# EAGLE design isocan (EAGLE 4.13)
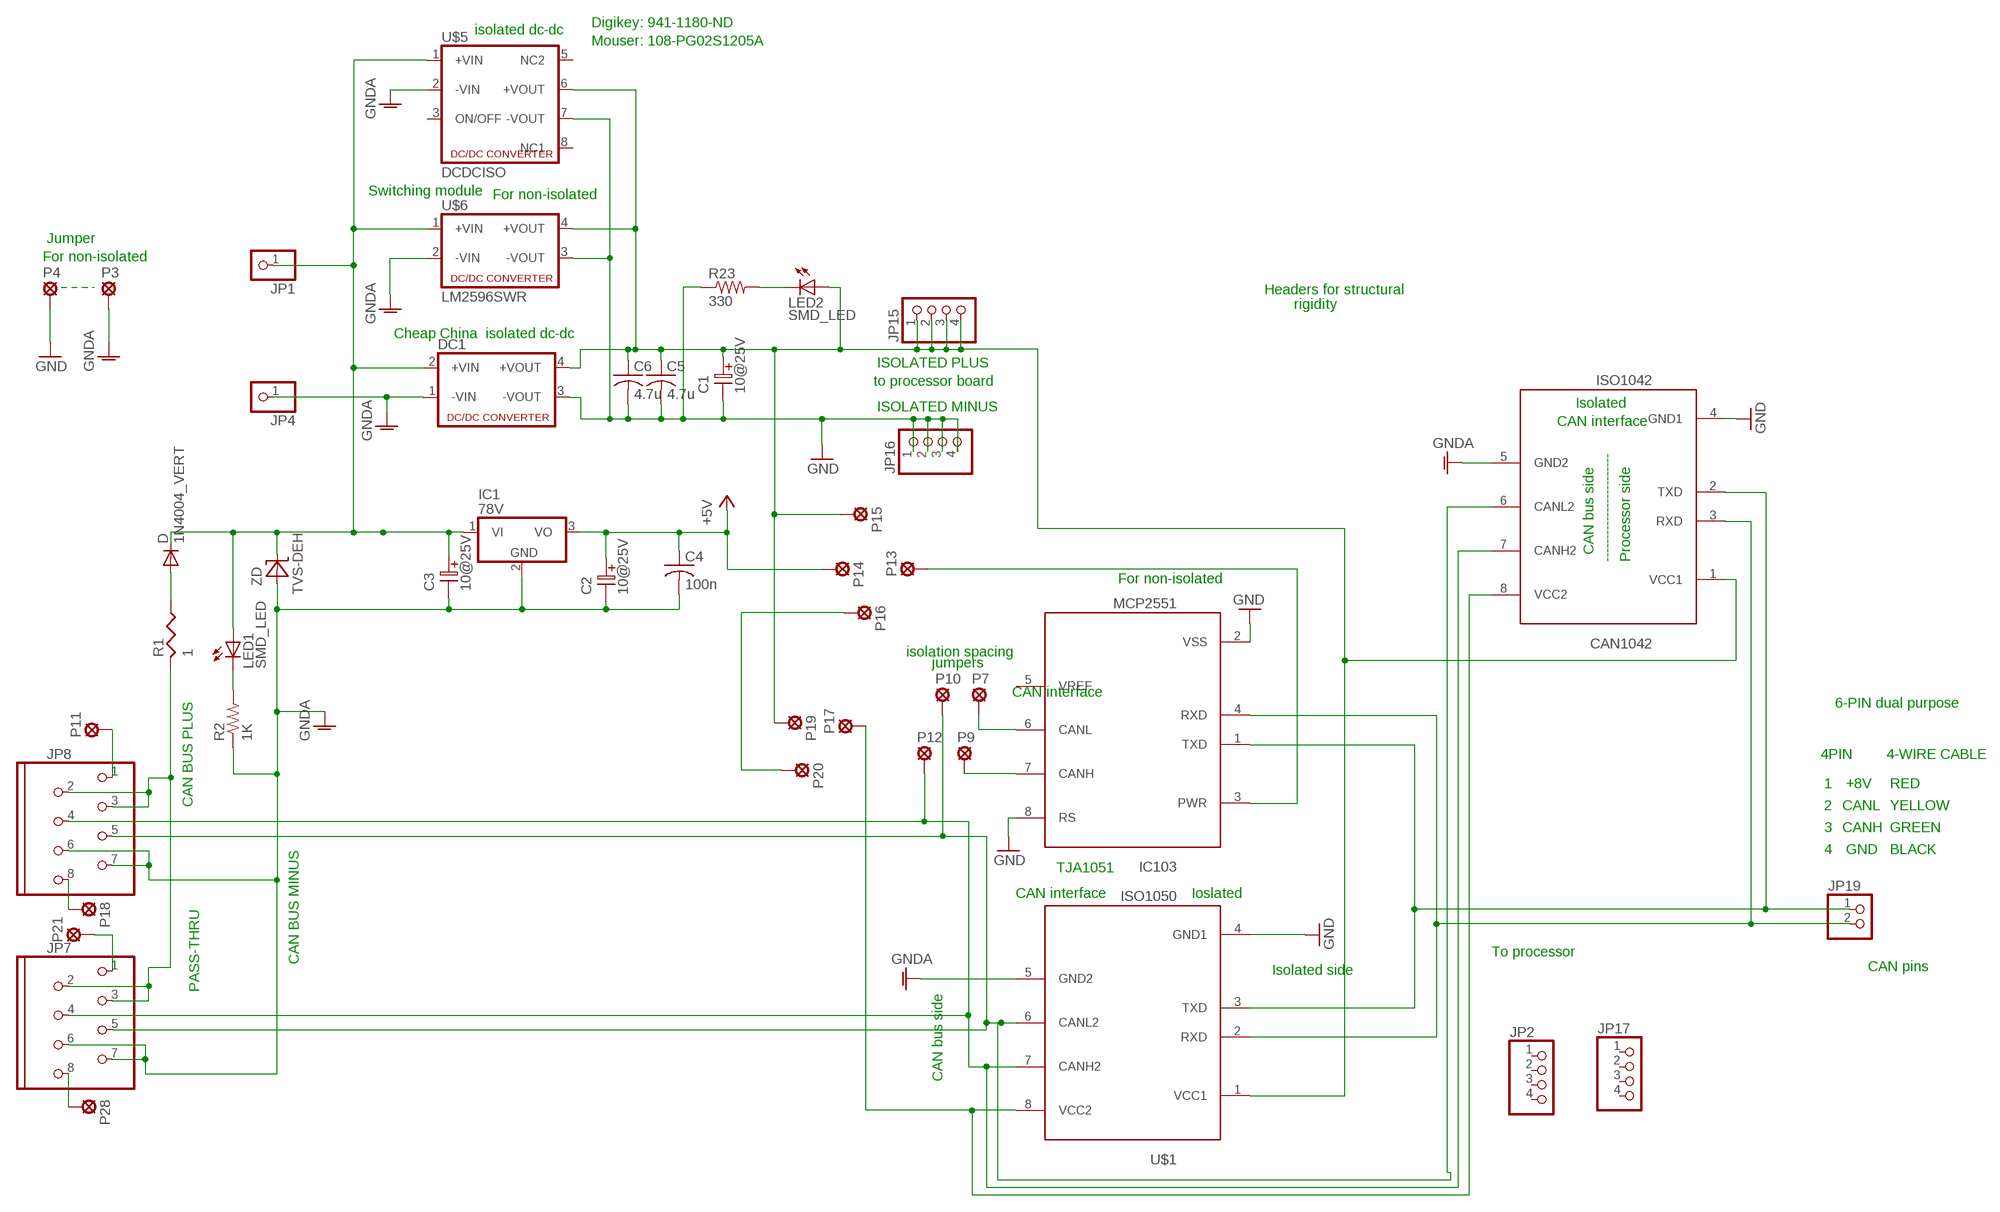
[diagram p0: schematic, sheet 1]

## Parts
C1  10@25V  ELC-2,5L  [ES-2,5L]
C2  10@25V  ELC-2,5L  [ES-2,5L]
C3  10@25V  ELC-2,5L  [ES-2,5L]
C4  100n  C-USC0603  [C0603]
C5  4.7u  C-USC0603  [C0603]
C6  4.7u  C-USC0603  [C0603]
CAN1042  ISO1042  [SO-08]
D  1N4004_VERT  [DO41-10_VERT]
DC1  NME  [NME]
IC1  78V  [TO220V]
IC103  MCP2551  [SO-08@1]
JP1  PINHD-1X1  [1X01]
JP2  PINHD-1X4  [1X04]
JP4  PINHD-1X1  [1X01]
JP7  MOD8P8C  [MOD8P8C]
JP8  MOD8P8C  [MOD8P8C]
JP15  PINHD-1X4  [1X04]
JP16  PINHD-1X4  [1X04]
JP17  PINHD-1X4  [1X04]
JP19  PINHD-1X2  [1X02]
LED1  SMD_LED  [SMD_LED]
LED2  SMD_LED  [SMD_LED]
P3  SOLPAD035  [SOLDPAD035]
P4  SOLPAD035  [SOLDPAD035]
P7  SOLPAD035  [SOLDPAD035]
P9  SOLPAD035  [SOLDPAD035]
P10  SOLPAD035  [SOLDPAD035]
P11  SOLPAD035  [SOLDPAD035]
P12  SOLPAD035  [SOLDPAD035]
P13  SOLPAD035  [SOLDPAD035]
P14  SOLPAD035  [SOLDPAD035]
P15  SOLPAD035  [SOLDPAD035]
P16  SOLPAD035  [SOLDPAD035]
P17  SOLPAD035  [SOLDPAD035]
P18  SOLPAD035  [SOLDPAD035]
P19  SOLPAD035  [SOLDPAD035]
P20  SOLPAD035  [SOLDPAD035]
P21  SOLPAD035  [SOLDPAD035]
P28  SOLPAD035  [SOLDPAD035]
R1  1  RESUS-S2,5  [RS-2,5]
R2  1K  R-US_R0603  [R0603]
R23  330  R-US_R0603  [R0603]
U$1  ISO1050  [PDSO-G8]
U$5  DCDCISO  [DCDC7PIN]
U$6  LM2596SWR  [LM2596SW]
ZD  TVS-DEH  [TVS-DEH]

## Nets
78L05_+: P16.MP P20.MP
+5V: C2.1 C4.1 IC1.3(VO) P14.MP
+12V_RESISTORED: D.A R1.1
CAN_DRVR_RXD: CAN1042.3(RXD) IC103.4(RXD) JP19.2 U$1.2(RXD)
CAN_DRVR_TXD: CAN1042.2(TXD) IC103.1(TXD) JP19.1 U$1.3(TXD)
CAN_PROTECTED+: C3.1 D.C DC1.2(+VIN) IC1.1(VI) JP1.1 LED1.A U$5.1(+VIN) U$6.1(+VIN) ZD.C
CAN_RAW_PLUS: JP7.2 JP7.3 JP8.2 JP8.3 R1.2
CANCABLE_1_1: JP8.1 P11.MP
CANCABLE_1_8: JP8.8 P18.MP
CANCABLE_2_1: JP7.1 P21.MP
CANCABLE_2_8: JP7.8 P28.MP
CANH: CAN1042.7(CANH2) JP7.4 JP8.4 P12.MP U$1.7(CANH2)
CANL: CAN1042.6(CANL2) JP7.5 JP8.5 P10.MP U$1.6(CANL2)
GND: C1.2 C5.2 C6.2 CAN1042.4(GND1) DC1.3(-VOUT) IC103.2(VSS) IC103.8(RS) JP16.1 JP16.2 JP16.3 JP16.4 P4.MP R23.1 U$1.4(GND1) U$5.7(-VOUT) U$6.3(-VOUT)
GNDA: C2.2 C3.2 C4.2 CAN1042.5(GND2) DC1.1(-VIN) IC1.2(GND) JP4.1 JP7.6 JP7.7 JP8.6 JP8.7 P3.MP R2.1 U$1.5(GND2) U$5.2(-VIN) U$6.2(-VIN) ZD.A
ISO1050_VCC2: CAN1042.8(VCC2) P17.MP U$1.8(VCC2)
ISO_PLUS: C1.1 C5.1 C6.1 CAN1042.1(VCC1) DC1.4(+VOUT) JP15.1 JP15.2 JP15.3 JP15.4 LED2.A P15.MP P19.MP U$1.1(VCC1) U$5.6(+VOUT) U$6.4(+VOUT)
LED_BUS_PWR: LED1.C R2.2
LED_EXT_BRD_PWR: LED2.C R23.2
MCP2551_CANH: IC103.7(CANH) P9.MP
MCP2551_CANL: IC103.6(CANL) P7.MP
MCP2551_PWR: IC103.3(PWR) P13.MP
Unconnected: IC103.5(VREF) JP2.1 JP2.2 JP2.3 JP2.4 JP17.1 JP17.2 JP17.3 JP17.4 U$5.3(ON/OFF) U$5.5(NC2) U$5.8(NC1)

## Notes on the sheet
- Digikey: 941-1180-ND
- isolated dc-dc
- Mouser: 108-PG02S1205A
- Switching module | For non-isolated
- Jumper
- For non-isolated
- Headers for structural
- rigidity
- Cheap China | isolated dc-dc
- ISOLATED PLUS
- to processor board
- ISOLATED MINUS | Isolated
- CAN interface
- CAN bus side
- ------------------------ | Processor side
- For non-isolated
- isolation spacing
- jumpers
- CAN interface
- 6-PIN dual purpose
- 4PIN | 4-WIRE CABLE
- 1 | +8V | RED
- CAN BUS PLUS | 2 | CANL | YELLOW
- 3 | CANH | GREEN
- 4 | GND | BLACK
- TJA1051
- CAN interface | Ioslated
- PASS-THRU
- To processor
- CAN BUS MINUS
- Isolated side | CAN pins
- CAN bus side

## Library data of the parts
C1-C3 = DEH:ELC-2,5L
C4-C6 = rcl:C-US: CAPACITOR, American symbol
CAN1042 = texas:ISO1042
D = diode:1N4004_VERT
DC1 = dc-dc-converter:NME: DC-DC CONVERTER
IC1 = linear:78*: Positive VOLTAGE REGULATOR
IC103 = texas:MCP2551
JP1 JP4 = pinhead:PINHD-1X1: PIN HEADER
JP2 JP15-JP17 = pinhead:PINHD-1X4: PIN HEADER
JP7 JP8 = DEH:MOD8P8C
JP19 = pinhead:PINHD-1X2: PIN HEADER
LED1 LED2 = led:SMD_LED
P3 P4 P7 P9-P21 P28 = solpad:SOLPAD035
R1 = DEH:RESUS-S2,5
R2 R23 = rcl:R-US_: RESISTOR, American symbol
U$1 = texas:ISO1050
U$5 = dc-dc-converter:DCDCISO
U$6 = dc-dc-converter:LM2596SWR
ZD = diode-1:TVS-DEH

## Board
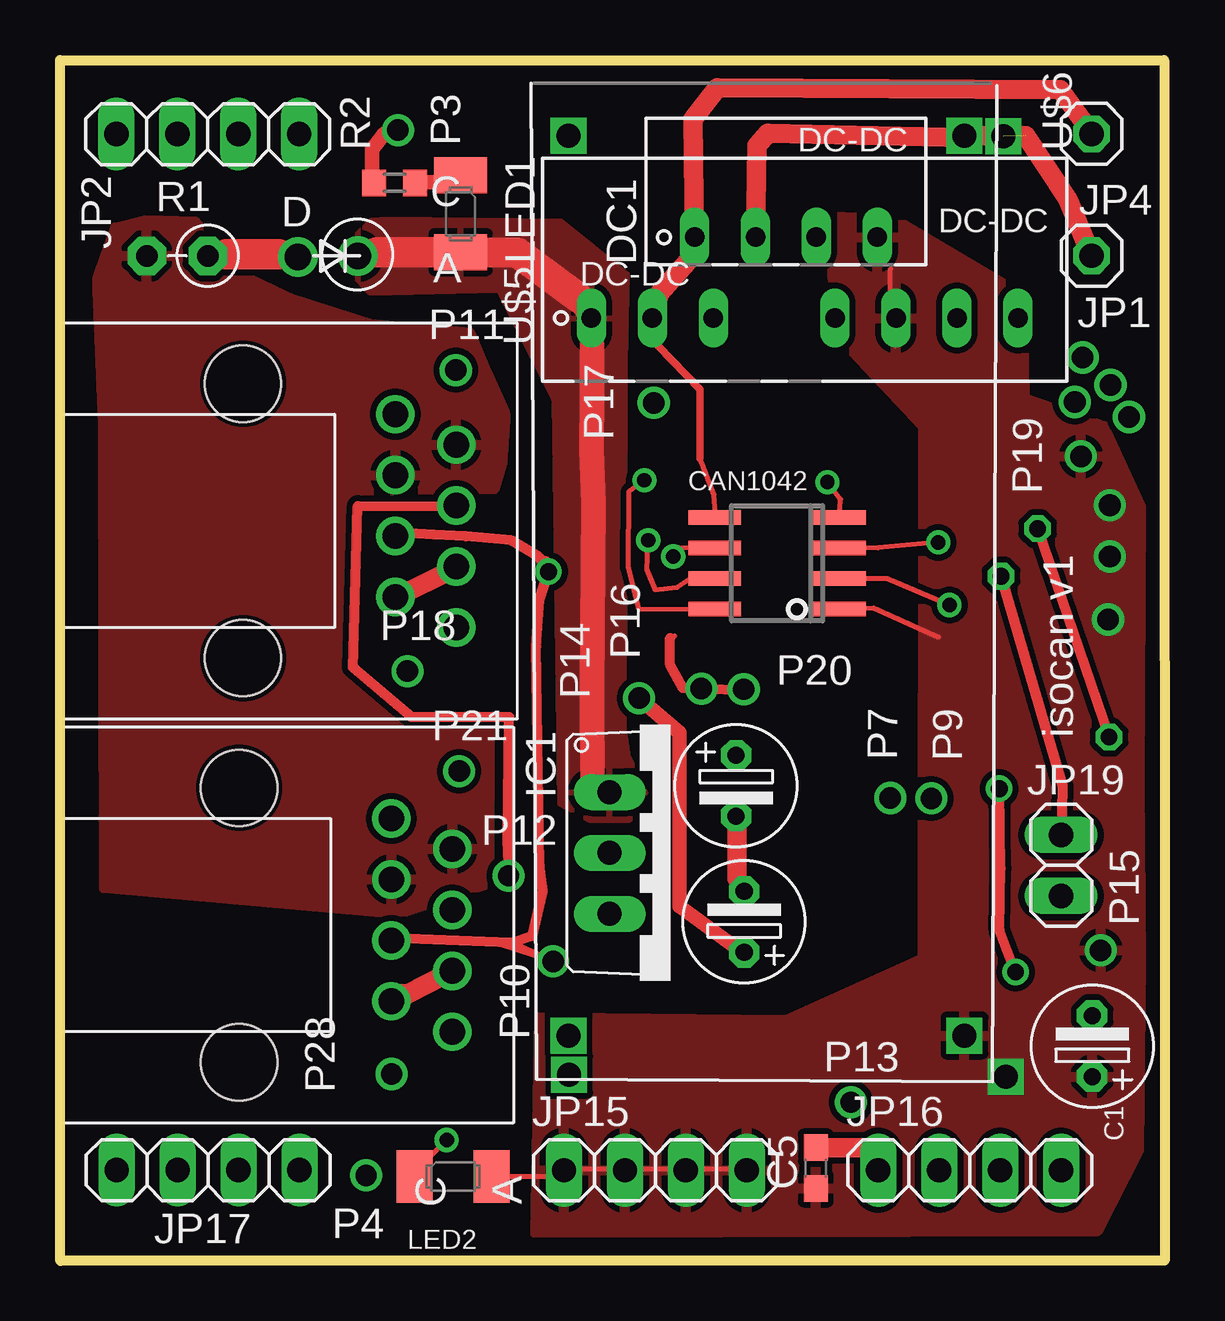
[diagram p1: board, top side]
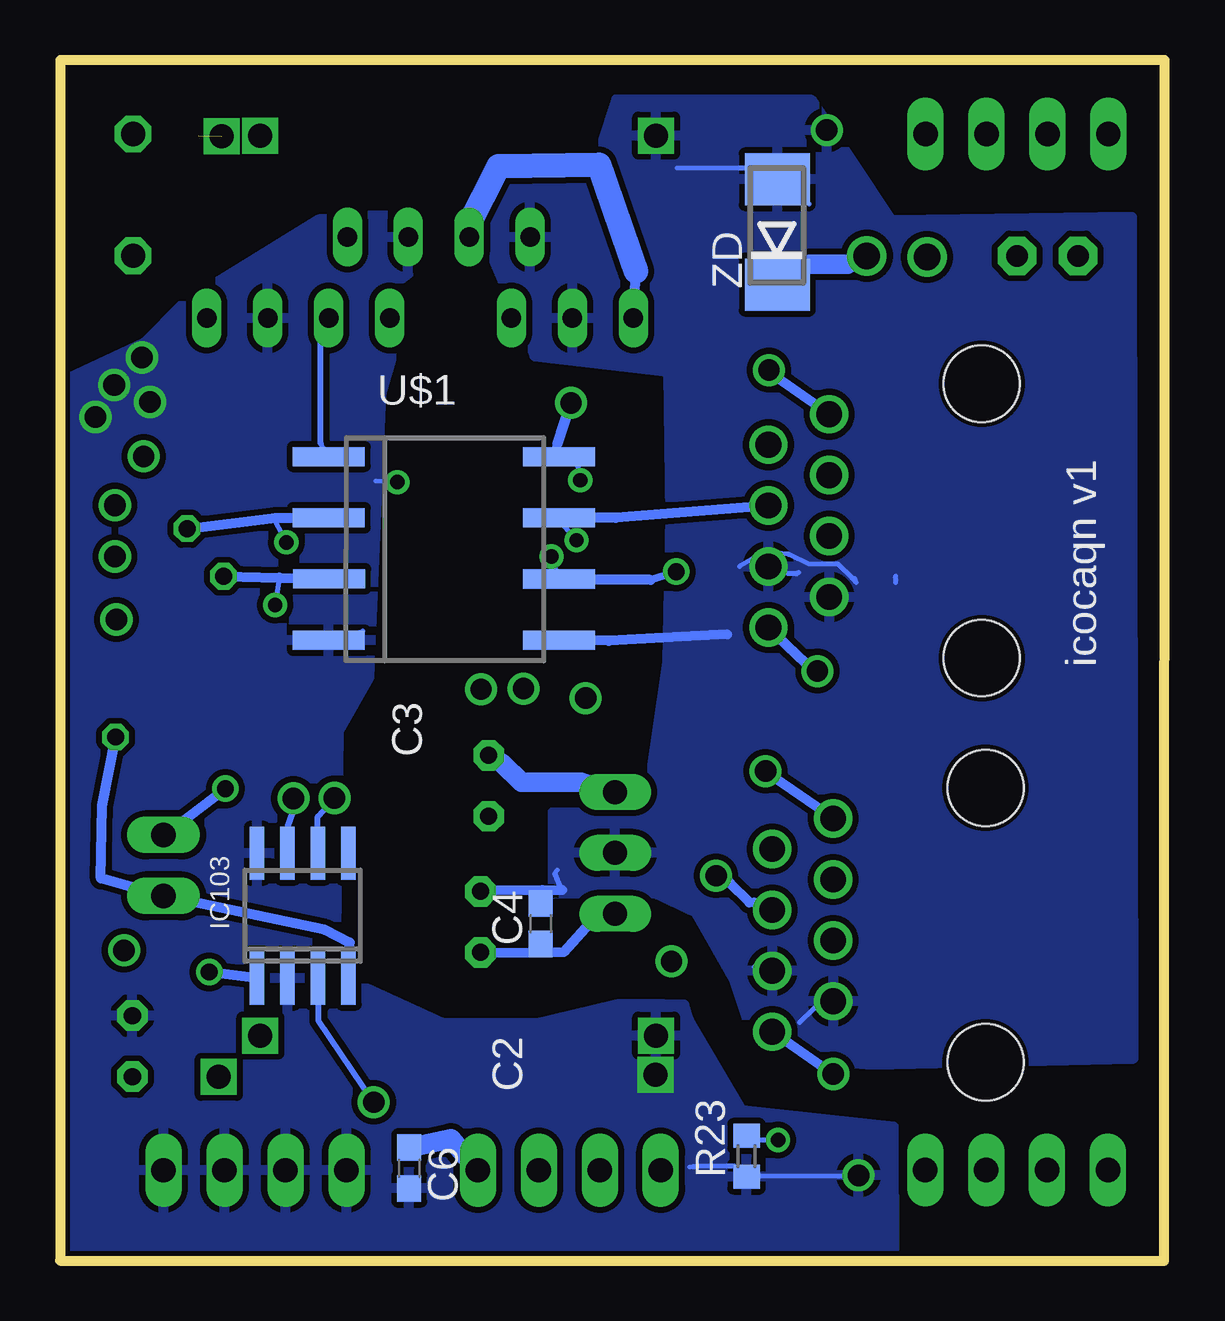
[diagram p2: board, bottom side, seen from below]

Size 46.05 x 50.04 mm. Coordinates in mm from the lower left corner, seen from the top.
Outline: 0.02,0 0,50.04 46.03,50.04 46.05,0.01 0.02,0.01
Copper layers (1*16): Top 0.035mm / dielectric 1.5mm / Bottom 0.035mm
Design rules "default": minimum track width 8mil, minimum drill 0.6mm, track to track 10mil, track to pad 10mil, pad to pad 10mil, via to via 8mil, smd to smd 0mil, copper to edge 8mil, drill to drill 8mil, minimum pad ring 8mil, minimum via ring 8mil, stop-mask expansion 4mil, vias tented up to drill 0mil, thermal gap 10mil

### Footprints (pad centres in the part's own frame; a part is rotated, then mirrored left to right if it is on the bottom)
ES-2,5L = drill 0.711 pad 1.27 octagon: 1 0,0; 2 2.54,0
C0603 = smd 1.1 x 1: 1 -0.85,0; 2 0.85,0
SO-08 = smd 0.6 x 2.2: 1 -1.905,-2.6; 2 -0.635,-2.6; 3 0.635,-2.6; 4 1.905,-2.6; 5 1.905,2.6; 6 0.635,2.6; 7 -0.635,2.6; 8 -1.905,2.6
DO41-10_VERT = drill 1.1 round: A 2.58,0.05; C 0.07,0
NME = drill 0.813 long: 1 0,3.81; 2 0,1.27; 3 0,-1.27; 4 0,-3.81
TO220V = drill 1 long: 1 -2.54,1.27; 2 0,1.27; 3 2.54,1.27
SO-08@1 = smd 0.6 x 2.2: 1 -1.905,-2.6; 2 -0.635,-2.6; 3 0.635,-2.6; 4 1.905,-2.6; 5 1.905,2.6; 6 0.635,2.6; 7 -0.635,2.6; 8 -1.905,2.6
1X01 = drill 1.016 octagon: 1 0,0
1X04 = drill 1.016 long: 1 -3.81,0; 2 -1.27,0; 3 1.27,0; 4 3.81,0
MOD8P8C = drill 1.067 pad 1.397 round: 1 -3.81,-2.54; 2 -2.54,0; 3 -1.27,-2.54; 4 0,0; 5 1.27,-2.54; 6 2.54,0; 7 3.81,-2.54; 8 5.08,0 | hole 3.175: -5.08,-8.89; 6.35,-8.89
1X02 = drill 1.016 long: 1 -1.27,0; 2 1.27,0
SMD_LED = smd 2.2 x 1.5: A 0,1.6; C 0,-1.6
SOLDPAD035 = drill 0.889 pad 1.27 round: MP 0,0
RS-2,5 = drill 0.9 pad 1.6 octagon: 1 0,0; 2 2.54,0
R0603 = smd 1 x 1.1: 1 -0.85,0; 2 0.85,0
PDSO-G8 = smd 0.8 x 3: 1 -3.825,-4.8; 2 -1.275,-4.8; 3 1.265,-4.78; 4 3.825,-4.8; 5 3.825,4.8; 6 1.275,4.8; 7 -1.275,4.81; 8 -3.825,4.81
DCDC7PIN = drill 0.813 long: 1 0,-0.03; 2 2.54,-0.03; 3 5.08,-0.03; 5 10.16,-0.03; 6 12.7,-0.03; 7 15.24,-0.03; 8 17.78,-0.03
LM2596SW = drill 1 square: 1 0,16.5; 2 0,0; 3 37.5,0; 4 37.5,16.5
TVS-DEH = smd 2.16 x 2.7: A 2.19,-0.05; C -2.2,-0.05

### Placement (x,y rotation side)
C1  43.03,7.68 90 top
C2  28.52,12.86 90 top
C3  28.18,21.07 270 top
C4  26.01,14.05 90 bottom
C5  31.5,3.87 90 top
C6  31.49,3.87 270 bottom
CAN1042  29.89,29.07 90 top
D  12.49,41.88 180 top
DC1  30.26,42.66 90 top
IC1  21.64,17 270 top
IC103  35.93,14.39 0 bottom
JP1  43,41.89 0 top
JP2  6.16,46.96 0 top
JP4  43,46.96 0 top
JP7  16.36,14.63 270 top
JP8  16.52,31.47 270 top
JP15  24.82,3.78 0 top
JP16  37.92,3.78 0 top
JP17  6.17,3.79 0 top
JP19  41.73,16.48 270 top
LED1  16.7,43.63 180 top
LED2  16.38,3.52 270 top
P3  14.09,47.12 0 top
P4  12.76,3.56 0 top
P7  34.61,19.29 0 top
P9  36.32,19.27 0 top
P10  20.56,12.48 0 top
P11  16.5,37.12 0 top
P12  18.7,16.05 0 top
P13  32.97,6.61 0 top
P14  24.14,23.45 0 top
P15  43.38,12.94 0 top
P16  26.73,23.85 0 top
P17  24.75,35.75 0 top
P18  14.48,24.58 0 top
P19  42.56,33.52 270 top
P20  28.5,23.82 0 top
P21  16.64,20.41 0 top
P28  13.82,7.79 0 top
R1  6.16,41.88 180 top
R2  13.95,44.92 0 top
R23  17.43,4.37 90 bottom
U$1  30.05,29.69 270 bottom
U$5  22.15,39.32 0 top
U$6  21.2,46.89 270 top
ZD  16.2,42.88 90 bottom

### Tracks (layer width: path | path; a pad name or v marks a point on that pad's centre or on a via)
78L05_+
  Top 0.203: 28.58,23.81 28.63,23.72 P20.MP | 25.43,25.96 25.62,26.04
  Top 0.406: 28.58,23.81 P16.MP 25.96,23.87 25.43,24.84 25.43,25.96
+5V
  Top 0.61: P14.MP 25.83,22 25.83,14.79 28.47,12.84 C2.1
  Bottom 0.203: 26.01,12.85 C4.1 26.35,12.85 | IC1.3 23.77,14.27
  Bottom 0.406: 23.11,14.44 IC1.3 23.65,14.35 | 26.01,12.85 25.05,12.87 23.77,14.27 | 26.35,12.85 27.96,12.82 C2.1
+12V_RESISTORED
  Top 1.016: R1.1 6.92,41.94 | 9.12,41.94 D.A
  Top 1.27: 6.92,41.94 9.12,41.94
CAN_DRVR_RXD  (via drill 0.6, 0.7)
  Top 0.203: CAN1042.3 34.1,29.71 v36.61,29.94
  Top 0.406: v43.73,21.83 v40.75,30.51
  Bottom 0.203: 37.06,30.96 37.06,30.78 v36.61,29.94
  Bottom 0.406: v40.75,30.51 37.06,30.96 U$1.2 | v43.73,21.83 44.3,18.96 44.35,15.94 41.57,15.16 JP19.2 41.75,15.21 35.01,13.8 33.97,13.26 IC103.4
CAN_DRVR_TXD  (via drill 0.6, 0.7)
  Top 0.203: CAN1042.2 34.47,28.43 v37.08,27.33
  Top 0.406: v39.23,28.53 41.8,19.8 41.75,17.6 JP19.1 | v39.83,12.04 39.16,13.79 39.2,16.36 v39.15,19.68
  Bottom 0.203: 36.91,28.47 36.91,28.45 v37.08,27.33
  Bottom 0.406: v39.23,28.53 36.91,28.47 U$1.3 | IC103.1 v39.83,12.04 | JP19.1 41.75,17.69 v39.15,19.68
CAN_PROTECTED+  (via drill 1)  (1 unrouted)
  Top 0.203: LED1.A 16.12,42.04
  Top 0.254: 22.15,33.81 22.49,33.81
  Top 0.406: 37.81,46.81 U$6.1 | 43.06,41.74 JP1.1
  Top 0.813: 13.22,42.04 D.C | 22.17,38.17 U$5.1 | DC1.2 29.06,46.47 29.51,46.99 37.81,46.81 | U$6.1 40.27,46.88 42.02,44.24 43.06,41.74 | 17.09,42.04 LED1.A
  Top 1.016: 22.17,38.17 22.17,36.07 22.15,33.81 22.23,31.58 22.17,23.73 22.19,19.6 IC1.1 | U$5.1 22.17,39.3 21.62,40.14
  Top 1.27: 16.12,42.04 13.22,42.04 | 21.62,40.14 19.08,42 17.09,42.04
  Bottom 0.203: 14.82,41.54 ZD.C | 29.09,43.02 DC1.2
  Bottom 0.406: U$5.1 22.05,41.24
  Bottom 0.813: 14.82,41.54 13.22,41.54 D.C | C3.1 27.62,20.74 26.82,19.94 24.32,19.94 IC1.1
  Bottom 1.016: 29.09,43.02 27.76,45.62 23.58,45.67 22.05,41.24
  other vias: 39.32,46.86
  pour Top: 12.99,43.35 11.93,42.36 11.97,41.38 12.92,40.35 18.28,40.47 20.61,35.86 20.84,19.06 22.06,18.39 23.76,18.39 24.39,19.5 23.68,21 23.52,22.14 23.56,37.48 23.64,41.1 20.88,43.31 13.7,43.39
CAN_RAW_PLUS
  pour Top: 17.78,37.05 18.57,35.3 18.43,33.26 18.09,32.15 13.82,32.11 12.07,31.7 12.07,25.38 17.9,22.66 17.88,15.71 14.1,14.45 1.84,15.52 1.8,34.9 1.56,40.95 2.3,43.06 3.62,43.38 5.61,43.33 7.53,41.12 9.72,40.07 12.92,39.05 17.09,38.69
CANCABLE_1_1
  Bottom 0.406: P11.MP 16.6,37.12 JP8.1
CANCABLE_1_8
  Bottom 0.406: P18.MP 14.56,24.53 JP8.8
CANCABLE_2_1
  Bottom 0.406: P21.MP 16.6,20.36 JP7.1
CANCABLE_2_8
  Bottom 0.406: P28.MP 13.77,7.73 JP7.8
CANH  (via drill 0.6)
  Top 0.203: CAN1042.7 26.19,28.38 25.72,28.07 24.8,27.97 24.45,28.83 24.48,29.81 v24.52,30.03
  Top 0.406: P12.MP 18.69,16.58 18.65,17.54 18.72,22.66 14.65,22.66 12.21,24.72 12.41,31.45 JP8.4
  Bottom 0.203: 17.12,14.94 17.32,14.94 | U$1.7 25.37,30.98 v24.52,30.03
  Bottom 0.406: 17.32,14.94 18.12,15.74 P12.MP | JP7.4 17.12,14.94 | U$1.7 22.88,30.96 JP8.4
CANL  (via drill 0.6, 0.7)
  Top 0.203: 13.64,13.4 13.92,13.46 18.3,13.22 P10.MP | 19.94,29.35 20.34,29.23 v20.36,28.72 | JP8.5 14.01,30.24 14.01,30.26 | v25.56,29.35 25.79,29.72 27.27,29.75 CAN1042.6
  Top 0.254: P10.MP 18.8,13.27 18.84,13.25 | 13.92,13.46 13.83,13.41
  Top 0.406: JP7.5 13.64,13.4 | v20.36,28.72 19.98,27.55 19.85,25.6 19.99,16.47 20.13,15.43 19.69,13.55 18.84,13.25 | 13.99,30.26 14.01,30.26 14.56,30.32 15.58,30.26 16.92,30.19 18.8,30.02 19.94,29.35 20.35,28.69 | 13.92,13.46 18.8,13.27
  Bottom 0.203: 25.18,28.38 U$1.6 v25.56,29.35
  Bottom 0.305: v20.36,28.72 21.43,28.38
  Bottom 0.406: 21.43,28.38 25.18,28.38
GND  (via drill 0.6, 0.9, 1)
  Top 0.203: CAN1042.4 32.54,31.74 v31.99,32.45
  Top 0.813: C5.2 33.78,4.72 34.08,3.73 JP16.1
  Bottom 0.203: P4.MP 13.42,3.54 16.92,3.54 R23.1 17.92,3.94 19.52,3.94 | 19.52,3.94 19.68,3.92 | U$1.4 33.42,26.24 | 19.52,3.94 19.62,3.92 19.79,3.91 | v31.99,32.45 32.89,32.49
  other vias: 42.63,37.64 43.79,36.5 42.3,35.79 44.57,35.17 21.22,7.76
  pour Bottom: 22.71,10.71 26.12,9.9 30.13,9.92 34.54,11.95 34.41,22.1 33.15,24.33 32.64,36.16 32.17,37.83 32.12,40.68 31.24,41.34 31.25,43.5 34.68,43.64 35.26,43.38 40.92,39.9 42.54,38.26 46.61,36.37 46.95,-1.22 19.52,-1.19 11.27,0 11.29,5.6 17.63,6.28 19.83,10.04 20.03,10.68 20.85,10.69
GNDA
  Top 0.203: 26.46,41.98 26.42,42.13 | R2.1 13.02,45.09 | 14.02,27.66 13.99,27.96 JP8.7 | JP8.6 | 15.23,11.51 15.23,11.5 15.26,11.45 13.99,11.45 JP7.7 | 26.68,33.45 27.27,31.93 27.33,31.14 CAN1042.5
  Top 0.305: 26.68,33.45 26.68,36.32 24.92,38.14 U$5.2
  Top 0.406: 43.06,46.92 JP4.1
  Top 0.61: 13.02,45.09 13,46.33 13.51,46.97 P3.MP
  Top 0.813: 26.46,41.98 25.02,40.34 U$5.2 | 26.42,42.13 DC1.1 26.39,47.58 27.41,48.88 41.7,48.8 43.06,46.92 | C3.2 28.22,17.94 28.22,15.94 C2.2 | 14.01,27.7 14.02,27.66 16.44,28.84 | 13.83,10.77 15.23,11.5 16.4,12.11
  Bottom 0.203: 15.42,28.64 15.72,28.64 | 15.42,28.64 15.32,28.64 | 15.22,9.94 14.62,10.54 JP7.7 | JP7.6 17.12,12.24 | 20.32,45.54 17.42,45.54 ZD.A 14.82,44.04 | 15.26,28.68 15.42,28.64 | 17.72,28.94 16.73,29.54 15.67,29.44 14.82,29.04 13.62,29.04 13.02,28.44 12.97,28.39 | 12.97,28.39 12.89,28.31 | 11.22,28.54 11.21,28.41 11.22,28.34 11.22,28.27 | 25.12,15.45 25.42,16.14 25.33,16.28 | 25.95,15.46 C4.2 25.74,15.42 | 12.97,28.39 12.92,28.44 12.87,28.26
  Bottom 0.406: 18.24,26.11 23.17,25.84 U$1.5 | 25.95,15.46 25.12,15.45 | 25.74,15.42 27.92,15.44 C2.2
  pour Bottom: 16.92,8.58 12.21,8.17 1.3,8.43 1.36,43.5 11.37,43.37 14.71,48.38 22.86,48.41 23.47,46.51 28.1,45.16 28.18,42.17 26.27,37.7 20.71,37.06 20.63,31 20.68,28.01 20.74,24.95 21.65,18.8 22.36,18.67 25.52,18.68 25.51,15.3 21.25,15.32 19.57,14.53 17.96,11.72
ISO1050_VCC2  (via drill 0.6)
  Top 0.203: CAN1042.8 24.14,27.18 23.69,28.9 23.72,32.07 v24.36,32.53
  Bottom 0.203: 25.32,34.04 25.42,33.94 U$1.8 25.37,33.51 24.52,33.51 v24.36,32.53
  Bottom 0.406: 25.32,34.04 P17.MP
ISO_PLUS  (via drill 0.9, 1)
  Top 0.203: 34.82,38.14 U$5.6 34.62,40.44 34.62,41.34 | LED2.A 18.62,3.54 20.32,3.54 JP15.1 21.72,3.84 22.82,3.84 JP15.2 24.22,3.84 25.42,3.84 JP15.3 26.82,3.84 27.92,3.84 JP15.4 | CAN1042.1 33.91,27.21 36.63,25.99
  Bottom 0.203: 35.18,38.36 U$5.6 | U$1.1 35.18,34.06
  Bottom 0.254: 35.18,34.06 35.18,38.36
  Bottom 0.813: C6.1 29.74,5.09 28.67,3.8 JP15.4
  other vias: 43.76,31.49 43.76,29.35 43.69,26.73 39.43,7.67
  pour Top: 19.96,10.15 19.8,1.17 43.25,1.24 44.99,4.64 45.08,12.49 45,19.92 45.07,31.43 43.53,34.79 40.21,35.94 40.16,40.21 34.7,43.45 31.71,43.51 32.7,38.25 35.97,34.79 35.95,12.59 30.27,10.03 20.87,10.14
LED_BUS_PWR
  Top 0.203: R2.2 15.22,44.94 | 16.12,44.94 LED1.C
  Top 0.61: 15.22,44.94 16.12,44.94
LED_EXT_BRD_PWR  (via drill 0.6)
  Top 0.203: v16.12,5.04 15.52,4.44 LED2.C
  Bottom 0.203: v16.12,5.04 16.92,5.04 R23.2
MCP2551_CANH
  Bottom 0.254: IC103.7 36.54,18.13 36.36,18.65 P9.MP
MCP2551_CANL
  Bottom 0.254: IC103.6 35.31,18.51 P7.MP
MCP2551_PWR
  Bottom 0.254: IC103.3 35.27,10.01 32.95,6.6 P13.MP

### Text on the board
tNames: isocan v1
bNames: icocaqn v1